# Altium project Korsze.PrjPcb
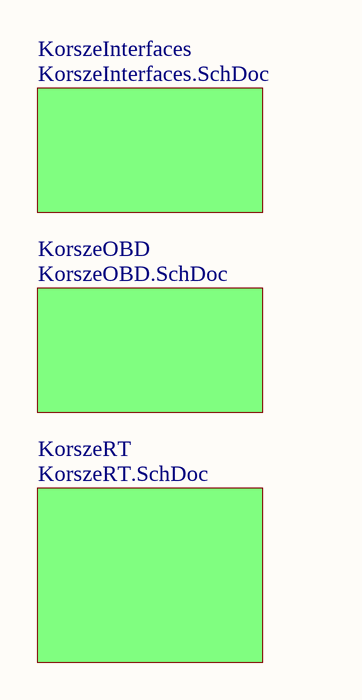
[diagram p0: Korsze.SchDoc]
6 sheets, 61 parts. Net scope: flat (ports and power ports of the same name join across sheets).
Sheets:
  Korsze.SchDoc
    KorszeInterfaces = KorszeInterfaces.SchDoc
      Designator = HuaweiE353.SchDoc
      Designator = TouchScreen.SchDoc
    KorszeOBD = KorszeOBD.SchDoc
    KorszeRT = KorszeRT.SchDoc

## Sheet Korsze.SchDoc
size A4

### Sub-sheets
KorszeInterfaces = KorszeInterfaces.SchDoc: no entries
KorszeOBD = KorszeOBD.SchDoc: no entries
KorszeRT = KorszeRT.SchDoc: no entries

## Sheet KorszeInterfaces.SchDoc
size A4
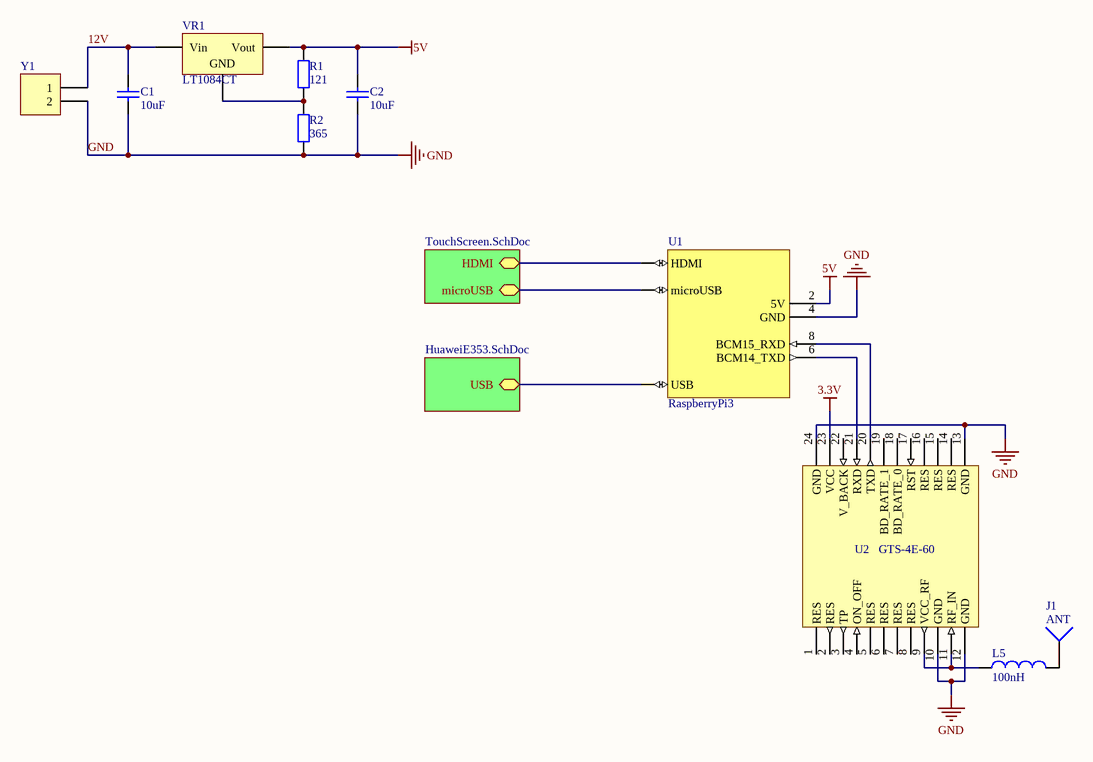
[diagram p1: KorszeInterfaces.SchDoc]

### Parts
C1  10uF  [RAD-0.3]
C2  10uF  [RAD-0.3]
J1  ANT  [PIN1]
L5  100nH  [0402-A]
R1  121  [AXIAL-0.4]
R2  365  [AXIAL-0.4]
U1  RaspberryPi3
U2  GTS-4E-60
VR1  LT1084CT  [TO-220-AB]
Y1  Header 2H  [HDR1X2H]  (value not drawn)

### Sub-sheets
Designator = HuaweiE353.SchDoc: USB (bidir)
Designator = TouchScreen.SchDoc: HDMI (bidir), microUSB (bidir)

### Nets
3.3V: U2.23(VCC)
5V: C2.2 R1.2 U1.2(5V) VR1.3(Vout)
GND: C1.1 C2.1 R2.1 U1.4(GND) U2.10(GND) U2.12(GND) U2.13(GND) U2.24(GND) Y1.2  [project net 12V]
12V: C1.2 VR1.1(Vin) Y1.1
NetJ1_1: J1.1 L5.2
NetL5_1: L5.1 U2.9(VCC_RF) U2.11(RF_IN)
NetR1_1: R1.1 R2.2 VR1.2(GND)
NetU1_6: U1.6(BCM14_TXD) U2.21(RXD)
NetU1_8: U1.8(BCM15_RXD) U2.20(TXD)
NetU1_?1: U1.?1(HDMI) ; sheet Designator/HDMI
NetU1_?2: U1.?2(microUSB) ; sheet Designator/microUSB
NetU1_?3: U1.?3(USB) ; sheet Designator/USB

Not connected (* = marked no-connect by the designer): U2 1(RES) 2(RES) 3(TP) 4(ON_OFF) 5(RES) 6(RES) 7(RES) 8(RES) 14(RES) 15(RES) 16(RES) 17(RST) 18(BD_RATE_0) 19(BD_RATE_1) 22(V_BACK)

### Library data of the parts
C1 C2 = Cap: Capacitor; Published: 8-Jun-2000; LatestRevisionDate: 17-Jul-2002; LatestRevisionNote: Re-released for DXP Platform.; PackageReference: RAD-0.3; Publisher: Altium Limited; PackageDescription: Radial Cap, Thru-Hole; 2 Leads; 0.3 in Pin Spacing; Value: 10uF
J1 = Socket: LatestRevisionDate: 17-Jul-2002; LatestRevisionNote: Re-released for DXP Platform.; Publisher: Altium Limited
L5 = Inductor: Code_IEC: 1005; Published: 8-Jun-2000; LatestRevisionDate: 29-May-2009; LatestRevisionNote: IPC-7351 Footprint Added.; PackageReference: 0402-A; Publisher: Altium Limited; PackageDescription: Chip Inductor; Code_JEITA: 0402; Value: 100nH
R1 R2 = Res2: Resistor; Published: 8-Jun-2000; LatestRevisionDate: 17-Jul-2002; LatestRevisionNote: Re-released for DXP Platform.; PackageReference: AXIAL-0.4; Publisher: Altium Limited; PackageDescription: Axial Device, Thru-Hole; 2 Leads; 0.4 in Pin Spacing
  R1: Value: 121
  R2: Value: 365
U2 = GTS-4E-60: FIBOCOM GTS-4E-60, GPS Module
VR1 = Volt Reg: Voltage Regulator; Published: 24-Mar-1999; LatestRevisionDate: 29-May-2009; LatestRevisionNote: IPC-7351 Footprint Added.; PackageReference: D2PAK; Publisher: Altium Limited; PackageDescription: 3-Pin Transistor Outline Package 2.54 mm Pitch, 15.1 mm Lead Span
Y1 = Header 2H: Header, 2-Pin, Right Angle; LatestRevisionDate: 17-Jul-2002; LatestRevisionNote: Re-released for DXP Platform.; Publisher: Altium Limited

## Sheet HuaweiE353.SchDoc
size A4
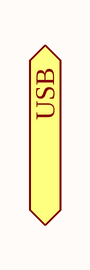
[diagram p2: HuaweiE353.SchDoc]

### Ports
USB (bidir)

## Sheet TouchScreen.SchDoc
size A4
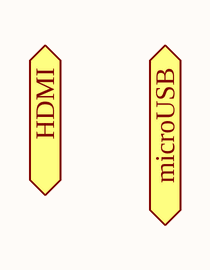
[diagram p3: TouchScreen.SchDoc]

### Ports
HDMI (bidir), microUSB (bidir)

## Sheet KorszeOBD.SchDoc
size A4
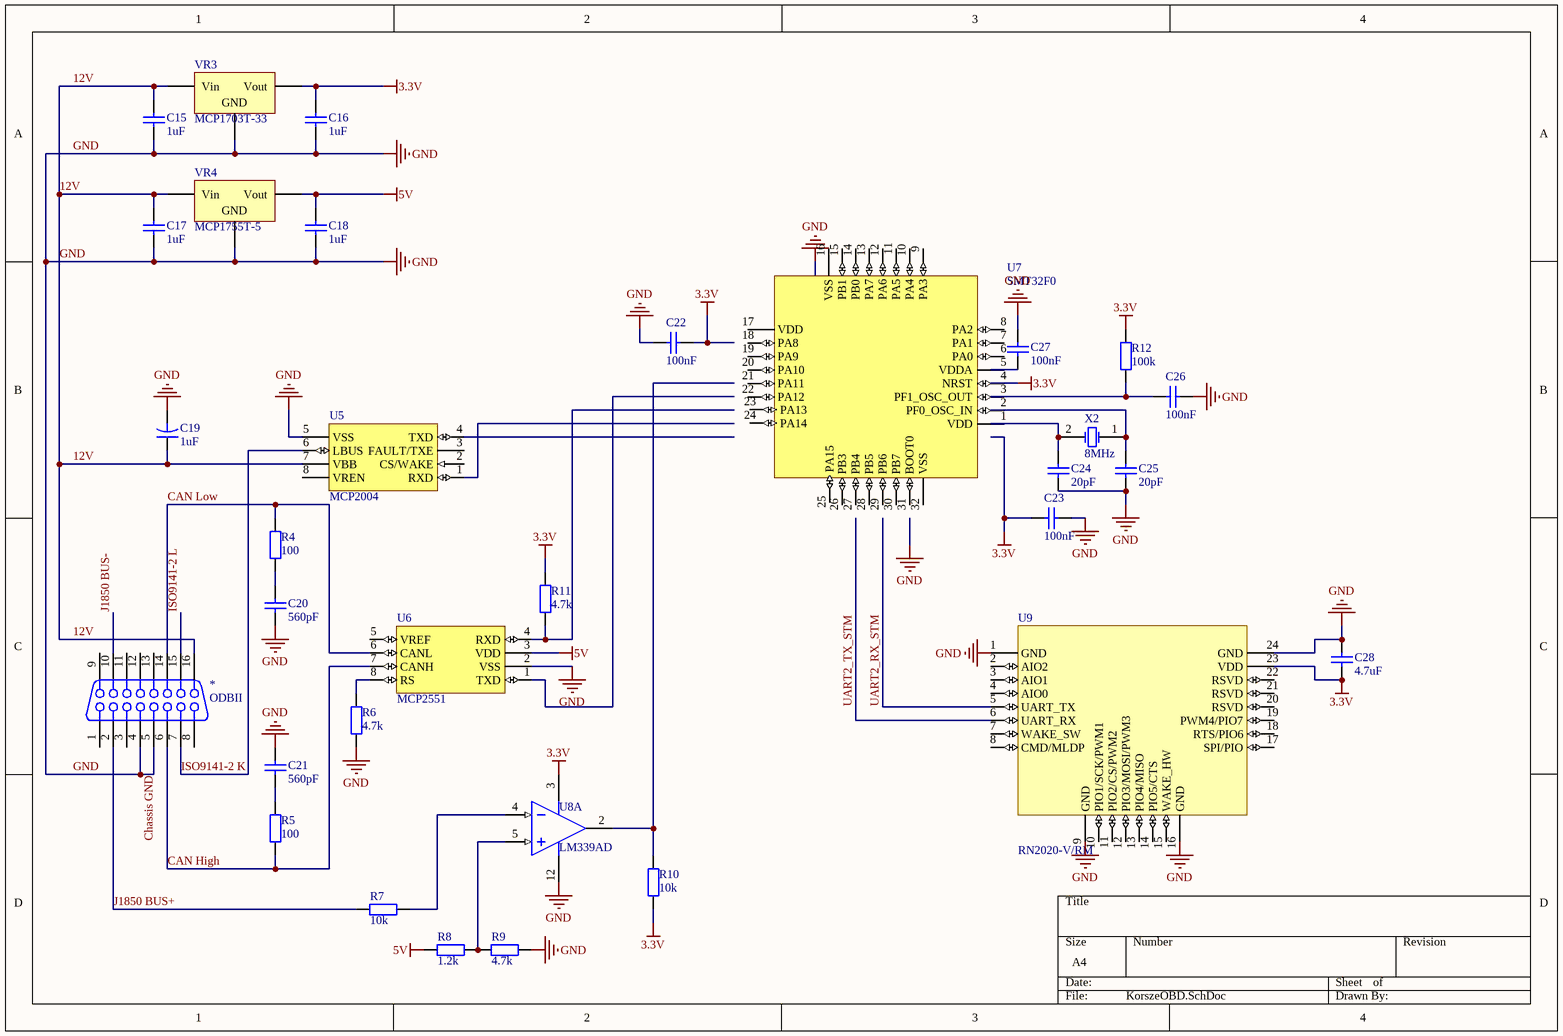
[diagram p4: KorszeOBD.SchDoc]

### Parts
*  ODBII  [HDR2X8H]
C15  1uF  [0402]
C16  1uF  [0402]
C17  1uF  [0402]
C18  1uF  [0402]
C19  1uF  [0402]
C20  560pF  [0402]
C21  560pF  [0402]
C22  100nF  [0402]
C23  100nF  [0402]
C24  20pF  [0402]
C25  20pF  [0402]
C26  100nF  [0402]
C27  100nF  [0402]
C28  4.7uF  [0402]
R4  100  [J1-0603]
R5  100  [J1-0603]
R6  4.7k  [J1-0603]
R7  10k  [J1-0603]
R8  1.2k  [J1-0603]
R9  4.7k  [J1-0603]
R10  10k  [J1-0603]
R11  4.7k  [J1-0603]
R12  100k  [J1-0603]
U5  MCP2004  [SO8_M]
U6  MCP2551  [SO8W_M]
U7  SMT32F0  [Model Name]
U8  LM339AD  [SO14_M]  (part A of 4)
U9  RN2020-V/RM  [RN4020 MODULE-24]
VR3  MCP1703T-33  [SOT23_M]
VR4  MCP1755T-5  [SOT23-6_M]
X2  8MHz  [R38]

### Nets
3.3V: C16.2 C22.2 C23.2 C28.1 R10.2 R11.1 R12.2 U7.4(NRST) U8.3(V+) U9.23(VDD) VR3.3(Vout)
5V: C18.2 R8.2 U6.3(VDD) VR4.3(Vout)
12V: *.4 *.5 *.16 C15.1 C15.2 C16.1 C17.1 C17.2 C18.1 C19.1 C19.2 C20.1 C21.2 C22.1 C23.1 C24.2 C25.2 C26.2 C27.2 C28.2 R6.1 R9.1 U5.5(VSS) U5.7(VBB) U6.2(VSS) U8.12(V-) U9.1(GND) U9.9(GND) U9.16(GND) U9.24(GND) VR3.1(Vin) VR3.2(GND) VR4.1(Vin) VR4.2(GND)  [also labelled Chassis GND, GND]
CAN High: *.6 R5.1 U6.7(CANH)
CAN Low: *.14 R4.2 U6.6(CANL)
ISO9141-2 K: *.7 U5.6(LBUS)
ISO9141-2 L: *.15
J1850 BUS+: *.2 R7.1
J1850 BUS-: *.10
UART2_RX_STM: U9.5(UART_TX)
UART2_TX_STM: U9.6(UART_RX)
NetC20_2: C20.2 R4.1
NetC21_1: C21.1 R5.2
NetC24_1: C24.1 U7.1(VDD) X2.2(OSC2)
NetC25_1: C25.1 U7.2(PF0_OSC_IN) X2.1(OSC1)
NetC26_1: C26.1 R12.1 U7.3(PF1_OSC_OUT)
NetC27_1: C27.1 U7.5(VDDA)
NetR6_2: R6.2 U6.8(RS)
NetR7_2: R7.2 U8.4(IN-)
NetR8_1: R8.1 R9.2 U8.5(IN+)
NetR10_1: R10.1 U8.2(OUT)
NetR11_2: R11.2 U6.4(RXD)

Not connected (* = marked no-connect by the designer): * 1 3 8 9 11 12 13; U5 1(RXD) 2(CS/WAKE) 3(FAULT/TXE) 4(TXD) 8(VREN); U6 1(TXD) 5(VREF); U7 6(PA0) 7(PA1) 8(PA2) 9(PA3) 10(PA4) 11(PA5) 12(PA6) 13(PA7) 14(PB0) 15(PB1) 16(VSS) 17(VDD) 18(PA8) 19(PA9) 20(PA10) 21(PA11) 22(PA12) 23(PA13) 24(PA14) 25(PA15) 26(PB3) 27(PB4) 28(PB5) 29(PB6) 30(PB7) 31(BOOT0) 32(VSS); U9 2(AIO2) 3(AIO1) 4(AIO0) 7(WAKE_SW) 8(CMD/MLDP) 10(PIO1/SCK/PWM1) 11(PIO2/CS/PWM2) 12(PIO3/MOSI/PWM3) 13(PIO4/MISO) 14(PIO5/CTS) 15(WAKE_HW) 17(SPI/PIO) 18(RTS/PIO6) 19(PWM4/PIO7) 20(RSVD) 21(RSVD) 22(RSVD)

### Library data of the parts
C15-C18 C20-C28 = Cap: Capacitor; Published: 8-Jun-2000; LatestRevisionDate: 17-Jul-2002; LatestRevisionNote: Re-released for DXP Platform.; PackageReference: RAD-0.3; Publisher: Altium Limited; PackageDescription: Radial Cap, Thru-Hole; 2 Leads; 0.3 in Pin Spacing
  C15-C18: Value: 1uF
  C20 C21: Value: 560pF
  C22 C23 C26 C27: Value: 100nF
  C24 C25: Value: 20pF
  C28: Value: 4.7uF
C19 = Cap2: Capacitor; Published: 23-Sep-2002; PackageReference: CAPR5-4X5; Publisher: Altium Limited; PackageDescription: Capacitor; 2 Leads; Value: 1uF
R4-R12 = Res2: Resistor; Published: 8-Jun-2000; LatestRevisionDate: 17-Jul-2002; LatestRevisionNote: Re-released for DXP Platform.; PackageReference: AXIAL-0.4; Publisher: Altium Limited; PackageDescription: Axial Device, Thru-Hole; 2 Leads; 0.4 in Pin Spacing
  R4 R5: Value: 100
  R6 R9 R11: Value: 4.7k
  R7 R10: Value: 10k
  R8: Value: 1.2k
  R12: Value: 100k
U5 = MCP2004A-E/SN: LIN Transceiver Michrochip Technology MCP2004A-E/SN
U6 = MCP2551-E/SN: CAN Transceiver Michrochip Technology MCP2551-E/SN
U7 = STM32F030K6T6
U8 = LM339AD: Low-Power Quad Voltage Comparator; Published: 24-Aug-2001; LatestRevisionDate: 13-Apr-2006; LatestRevisionNote: IPC-7351 Footprint Added.; DatasheetVersion: Jun-1998; PackageVersion: Sep-1998; PackageReference: SO14; Publisher: Altium Limited; PackageDescription: 14-Pin Small Outline Integrated Circuit 1.27 mm Pitch; Code_IPC: SOIC127P600-14; ComponentLink1Description: Manufacturer Link; ComponentLink1URL: http://www.st.com/; ComponentLink2Description: Datasheet; ComponentLink2URL: http://www.st.com/stonline/products/literature/ds/2159/lm239.pdf
U9 = RN2020-V/RM123: Microchip RN4020 Bluetooth
VR3 VR4 = Volt Reg: Voltage Regulator; Published: 24-Mar-1999; LatestRevisionDate: 29-May-2009; LatestRevisionNote: IPC-7351 Footprint Added.; PackageReference: D2PAK; Publisher: Altium Limited; PackageDescription: 3-Pin Transistor Outline Package 2.54 mm Pitch, 15.1 mm Lead Span
X2 = XTAL: Crystal Oscillator; Published: 8-Jun-2000; LatestRevisionDate: 17-Jul-2002; LatestRevisionNote: Re-released for DXP Platform.; PackageReference: R38; Publisher: Altium Limited; PackageDescription: Crystal, Thru-Hole; 2 Leads; Body 3.1 x 8.2 mm (Dia.xH)

## Sheet KorszeRT.SchDoc
size A4
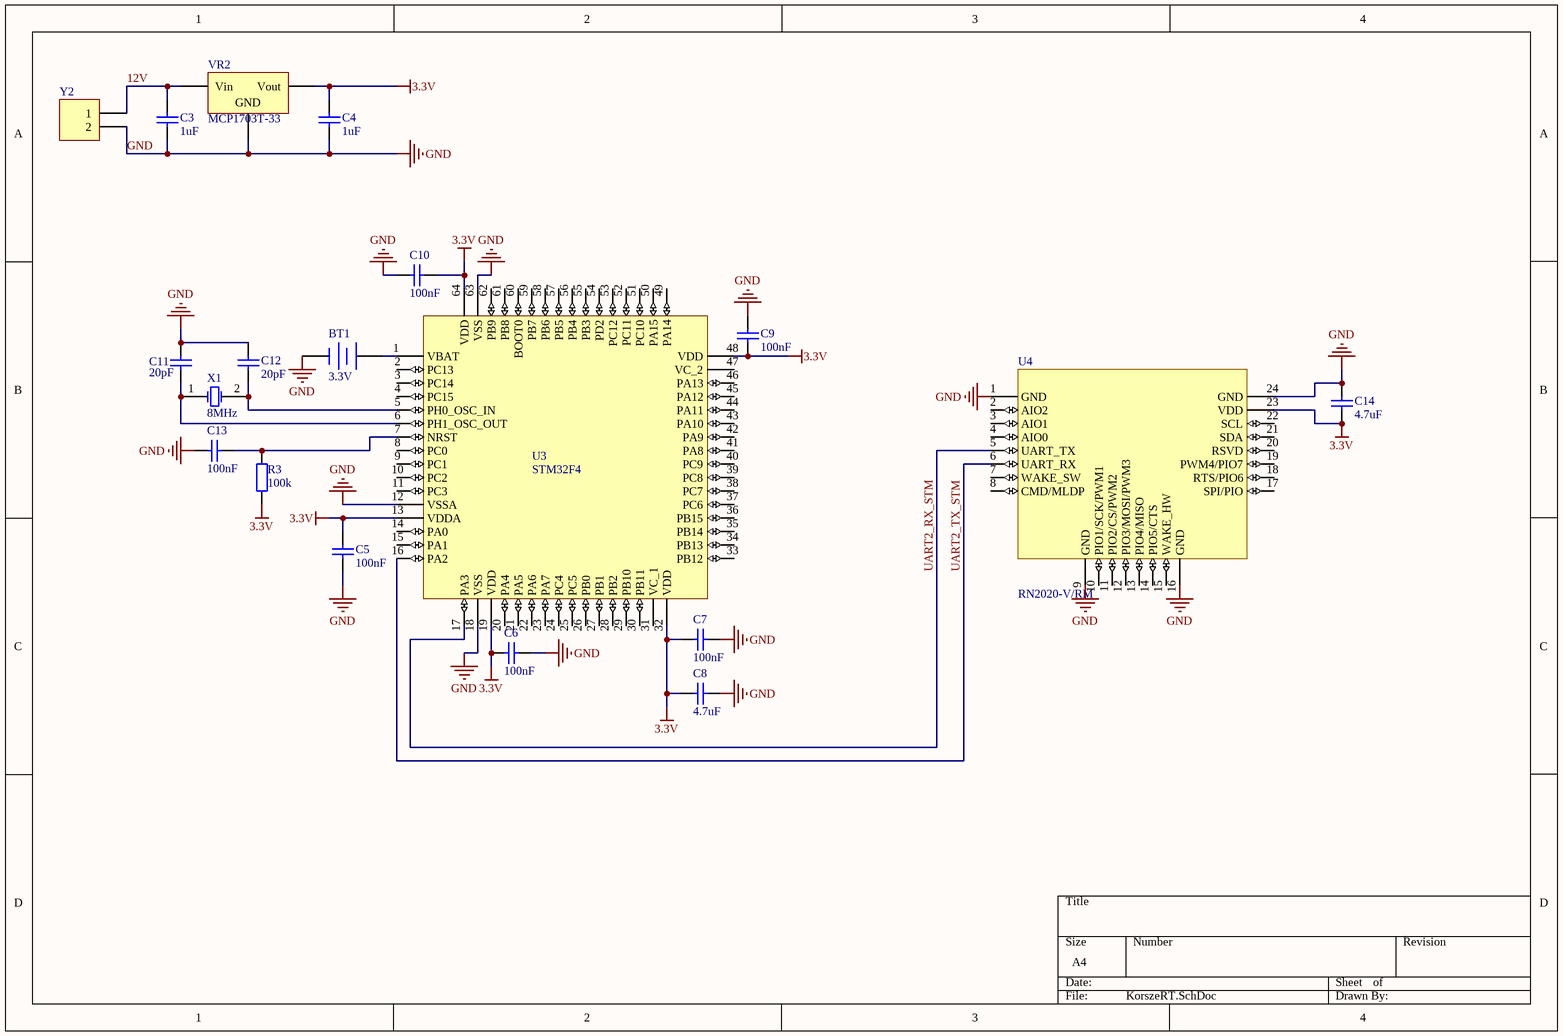
[diagram p5: KorszeRT.SchDoc]

### Parts
BT1  3.3V  [BAT-2]
C3  1uF  [RAD-0.3]
C4  1uF  [RAD-0.3]
C5  100nF  [RAD-0.3]
C6  100nF  [RAD-0.3]
C7  100nF  [RAD-0.3]
C8  4.7uF  [RAD-0.3]
C9  100nF  [RAD-0.3]
C10  100nF  [RAD-0.3]
C11  20pF  [RAD-0.3]
C12  20pF  [RAD-0.3]
C13  100nF  [RAD-0.3]
C14  4.7uF  [RAD-0.3]
R3  100k  [AXIAL-0.4]
U3  STM32F4  [TQFP64_M]
U4  RN2020-V/RM  [RN4020 MODULE-24]
VR2  MCP1703T-33  [SOT23_M]
X1  8MHz  [R38]
Y2  Header 2H  [HDR1X2H]  (value not drawn)

### Nets
3.3V: C4.2 C5.2 C6.2 C7.2 C8.1 C9.1 C10.2 C14.1 R3.2 U3.13(VDDA) U3.19(VDD) U3.32(VDD) U3.48(VDD) U3.64(VDD) U4.23(VDD) VR2.3(Vout)
GND: BT1.2(-) C3.1 C4.1 C5.1 C6.1 C7.1 C8.2 C9.2 C10.1 C11.2 C12.2 C13.2 C14.2 U3.12(VSSA) U3.18(VSS) U3.63(VSS) U4.1(GND) U4.9(GND) U4.16(GND) U4.24(GND) VR2.2(GND) Y2.2  [project net 12V]
12V: C3.2 VR2.1(Vin) Y2.1
UART2_RX_STM: U3.17(PA3) U4.5(UART_TX)
UART2_TX_STM: U3.16(PA2) U4.6(UART_RX)
NetBT1_1: BT1.1(+) U3.1(VBAT)
NetC11_1: C11.1 U3.6(PH1_OSC_OUT) X1.1(OSC1)
NetC12_1: C12.1 U3.5(PH0_OSC_IN) X1.2(OSC2)
NetC13_1: C13.1 R3.1 U3.7(NRST)

Not connected (* = marked no-connect by the designer): U3 2(PC13) 3(PC14) 4(PC15) 8(PC0) 9(PC1) 10(PC2) 11(PC3) 14(PA0) 15(PA1) 20(PA4) 21(PA5) 22(PA6) 23(PA7) 24(PC4) 25(PC5) 26(PB0) 27(PB1) 28(PB2) 29(PB10) 30(PB11) 31(VC_1) 33(PB12) 34(PB13) 35(PB14) 36(PB15) 37(PC6) 38(PC7) 39(PC8) 40(PC9) 41(PA8) 42(PA9) 43(PA10) 44(PA11) 45(PA12) 46(PA13) 47(VC_2) 49(PA14) 50(PA15) 51(PC10) 52(PC11) 53(PC12) 54(PD2) 55(PB3) 56(PB4) 57(PB5) 58(PB6) 59(PB7) 60(BOOT0) 61(PB8) 62(PB9); U4 2(AIO2) 3(AIO1) 4(AIO0) 7(WAKE_SW) 8(CMD/MLDP) 10(PIO1/SCK/PWM1) 11(PIO2/CS/PWM2) 12(PIO3/MOSI/PWM3) 13(PIO4/MISO) 14(PIO5/CTS) 15(WAKE_HW) 17(SPI/PIO) 18(RTS/PIO6) 19(PWM4/PIO7) 20(RSVD) 21(SDA) 22(SCL)

### Library data of the parts
BT1 = Battery: Multicell Battery; Published: 24-Mar-1999; LatestRevisionDate: 17-Jul-2002; LatestRevisionNote: Re-released for DXP Platform.; PackageReference: BAT-2; Publisher: Altium Limited; PackageDescription: Battery; 2 Leads
C3-C14 = Cap: Capacitor; Published: 8-Jun-2000; LatestRevisionDate: 17-Jul-2002; LatestRevisionNote: Re-released for DXP Platform.; PackageReference: RAD-0.3; Publisher: Altium Limited; PackageDescription: Radial Cap, Thru-Hole; 2 Leads; 0.3 in Pin Spacing
  C3 C4: Value: 1uF
  C5-C7 C9 C10 C13: Value: 100nF
  C8 C14: Value: 4.7uF
  C11 C12: Value: 20pF
R3 = Res2: Resistor; Published: 8-Jun-2000; LatestRevisionDate: 17-Jul-2002; LatestRevisionNote: Re-released for DXP Platform.; PackageReference: AXIAL-0.4; Publisher: Altium Limited; PackageDescription: Axial Device, Thru-Hole; 2 Leads; 0.4 in Pin Spacing; Value: 100k
U3 = STM32F405RGT6
U4 = RN2020-V/RM123: Microchip RN4020 Bluetooth
VR2 = Volt Reg: Voltage Regulator; Published: 24-Mar-1999; LatestRevisionDate: 29-May-2009; LatestRevisionNote: IPC-7351 Footprint Added.; PackageReference: D2PAK; Publisher: Altium Limited; PackageDescription: 3-Pin Transistor Outline Package 2.54 mm Pitch, 15.1 mm Lead Span
X1 = XTAL: Crystal Oscillator; Published: 8-Jun-2000; LatestRevisionDate: 17-Jul-2002; LatestRevisionNote: Re-released for DXP Platform.; PackageReference: R38; Publisher: Altium Limited; PackageDescription: Crystal, Thru-Hole; 2 Leads; Body 3.1 x 8.2 mm (Dia.xH)
Y2 = Header 2H: Header, 2-Pin, Right Angle; LatestRevisionDate: 17-Jul-2002; LatestRevisionNote: Re-released for DXP Platform.; Publisher: Altium Limited

## Nets that join several sheets
3.3V: KorszeInterfaces (U2.23), KorszeOBD (11 pins), KorszeRT (16 pins)
5V: KorszeInterfaces (C2.2 R1.2 U1.2 VR1.3), KorszeOBD (C18.2 R8.2 U6.3 VR4.3)
12V: KorszeInterfaces (9 pins), KorszeOBD (34 pins), KorszeRT (22 pins)